# EAGLE schematic LoRa Node Schematic (EAGLE 8.6.0)
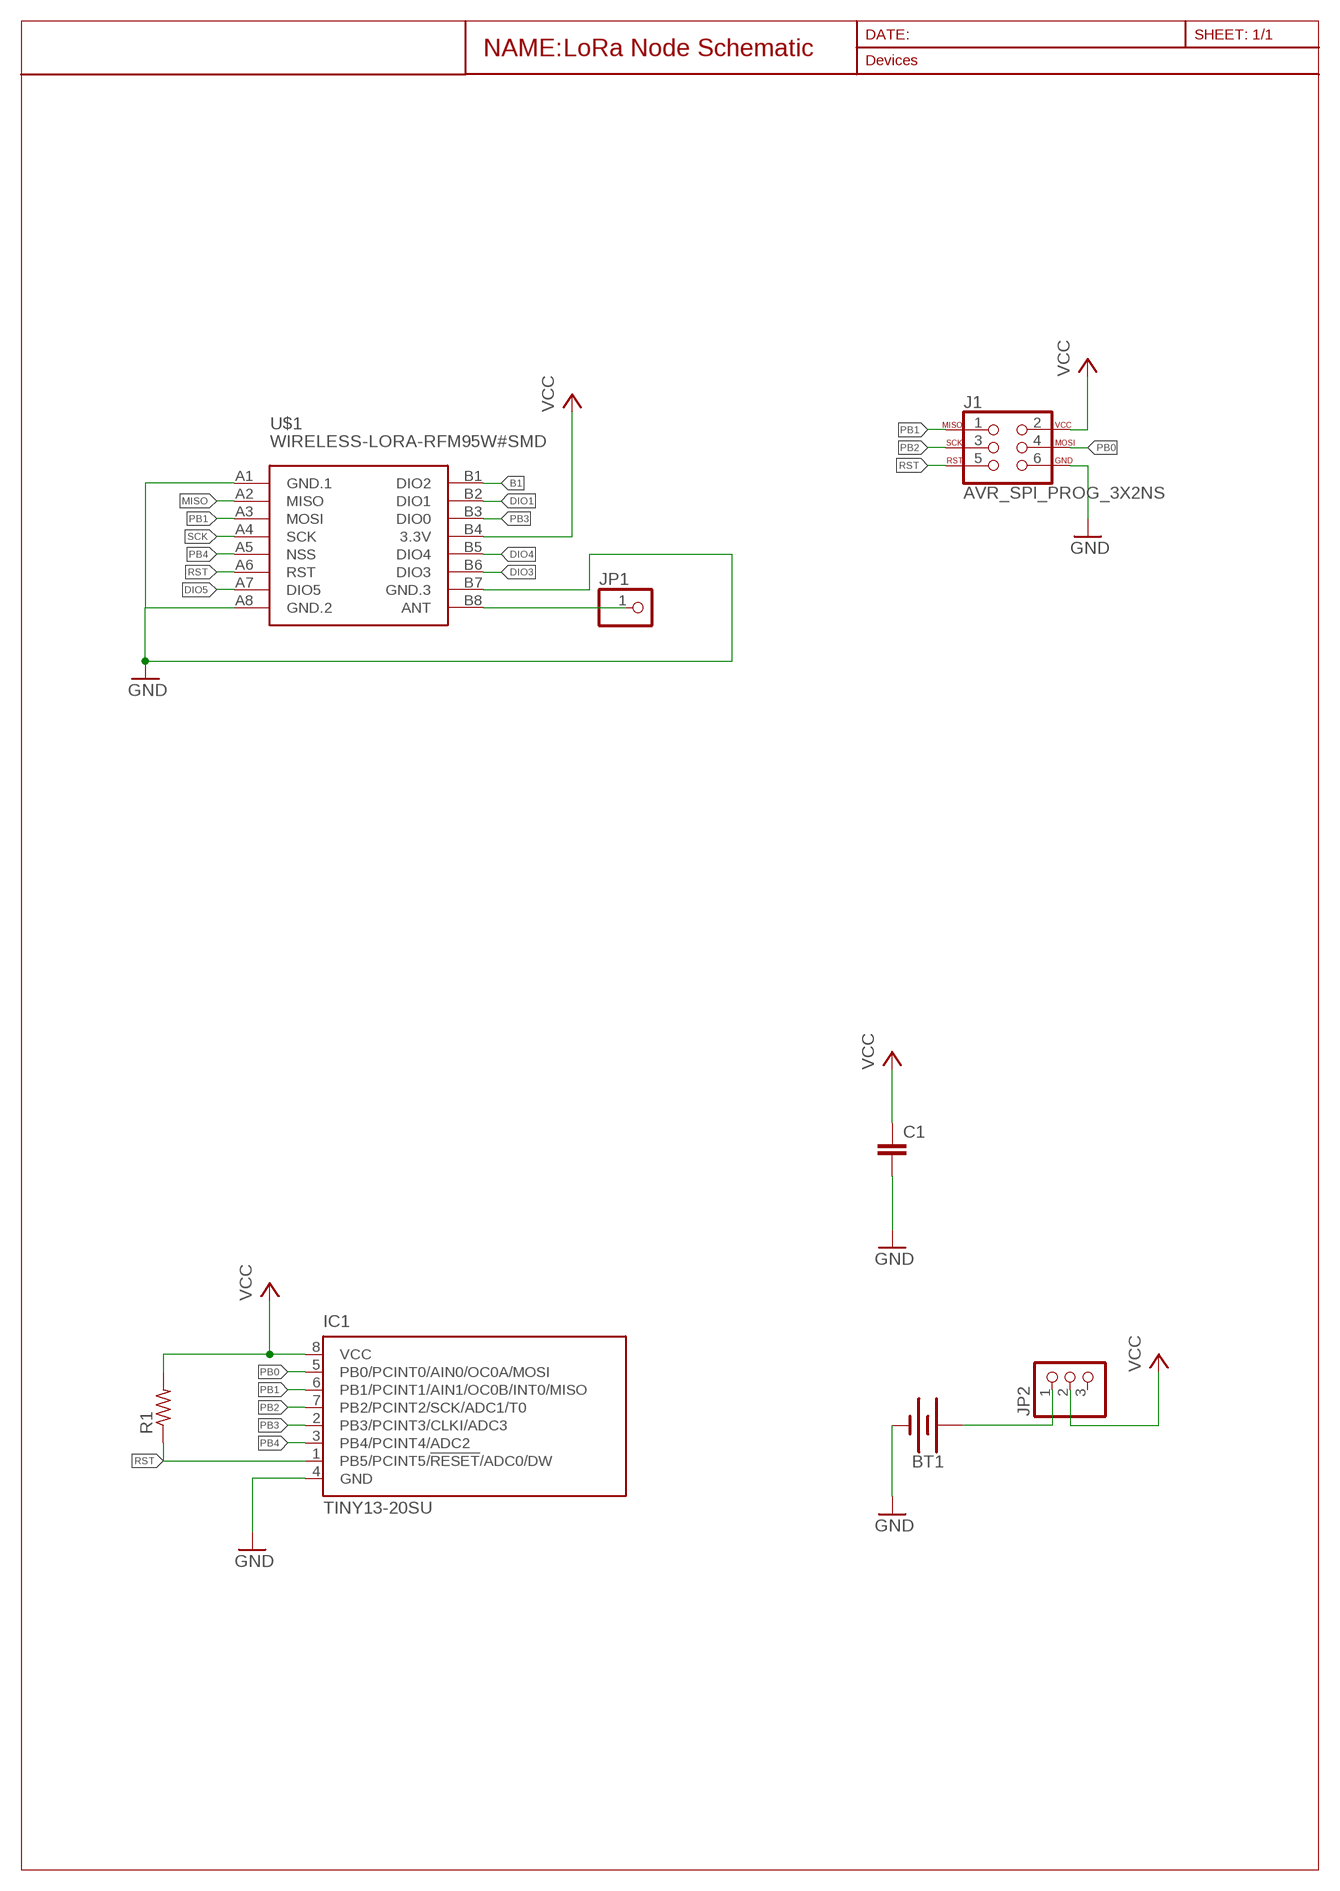
[diagram p0: schematic, sheet 1]
LORANODE (A4-35SC): NOME: LoRa Node

## Parts
BT1  BATTERY-20MM_PTH  [BATTCOM_20MM_PTH]
C1  C-EUC0603  [C0603]
IC1  TINY13-20SU  [8S2]
J1  AVR_SPI_PROG_3X2NS  [2X3-NS]
JP1  PINHD-1X1CB  [1X01-CLEANBIG]
JP2  PINHD-1X3  [1X03]
R1  R-US_R0603  [R0603]
U$1  WIRELESS-LORA-RFM95W#SMD  [WIRELESS-LORA-RFM95W#SMD]

## Nets
ANT: JP1.1 U$1.B8(ANT)
B1: U$1.B1(DIO2)
DIO1: U$1.B2(DIO1)
DIO3: U$1.B6(DIO3)
DIO4: U$1.B5(DIO4)
DIO5: U$1.A7(DIO5)
GND: BT1.2(-) C1.2 IC1.4(GND) J1.6 U$1.A1(GND.1) U$1.A8(GND.2) U$1.B7(GND.3)
MISO: U$1.A2(MISO)
N$20: BT1.1(+) JP2.1
PB0: IC1.5(PB0/PCINT0/AIN0/OC0A/MOSI) J1.4
PB1: IC1.6(PB1/PCINT1/AIN1/OC0B/INT0/MISO) J1.1 U$1.A3(MOSI)
PB2: IC1.7(PB2/PCINT2/SCK/ADC1/T0) J1.3
PB3: IC1.2(PB3/PCINT3/CLKI/ADC3) U$1.B3(DIO0)
PB4: IC1.3(PB4/PCINT4/ADC2) U$1.A5(NSS)
RST: IC1.1(PB5/PCINT5/!RESET!/ADC0/DW) J1.5 R1.1 U$1.A6(RST)
SCK: U$1.A4(SCK)
VCC: C1.1 IC1.8(VCC) J1.2 JP2.2 R1.2 U$1.B4(3.3V)
Unconnected: JP2.3

## Library data of the parts
BT1 = SparkFun-Batteries:BATTERY: Battery - Single Cell A variety of battery chemistries, sizes, and footprints. Device List: 20MM_PTH - Coin Cell Battery Holder - 20mm (PTH) <https://www.sparkfun.com/products/783> 6.8MM_PTH - Coin Cell Battery Holder - 6.8MM(SMD) <https://www.digikey.com/product-detail/en/seiko-instruments/MS621FE-FL11E/728-1057-ND/1889208?WT.srch=1&gclid=CNOQ5a6LzdQCFZS2wAodXCkE0g> 12MM_SMD - Coin Cell Battery Holder - 12mm (SMD) <https://www.sparkfun.com/products/10592> 12MM_PTH - Coin Cell Battery Holder - 12mm (PTH) <https://www.sparkfun.com/products/7948> 20MM_SMD - 20mm Coin Cell Battery Holder (SMD) (2 legs) Used on the Big Time Watch Kit <https://www.sparkfun.com/products/11734> 20MM_SMD_4LEGS - Coin Cell Battery Holder - 20mm (SMD) <https://www.sparkfun.com/products/11892> 20MM_SMD_4LEGS_OVERPASTE - Coin Cell Battery Holder - 20mm (SMD) <https://www.sparkfun.com/products/11892> (Over-paste on the legs) 24.5MM_PTH - Coin Cell Battery Holder - 24.5mm (PTH) <https://www.sparkfun.com/products/8863> 9V - 9V Battery Holder - PC Mount Used on the SparkFun SparkPunk Sound Kit <https://www.sparkfun.com/products/11177> and SparkFun SparkPunk Sequencer Kit <https://www.sparkfun.com/products/12707> 18650 - Battery Holder - 18650 (PTH) <https://www.sparkfun.com/products/13113> AA - Battery Holder - 1xAA (PTH) <https://www.sparkfun.com/products/7949> AAA - Battery Holder - 1xAAA (PTH) <https://www.sparkfun.com/products/12718> AA_KIT - Battery Holder - 1xAA (PTH) <https://www.sparkfun.com/products/7949> Special kit package - pads only have exposed copper on one side of the board. AAA_KIT - Battery Holder - 1xAAA (PTH) <https://www.sparkfun.com/products/12718> Special kit package - pads only have exposed copper on one side of the board.; PROD_ID: BATT-09031; SF_SKU: PRT-00783
C1 = rcl:C-EU: CAPACITOR, European symbol; SPICEPREFIX: C
IC1 = atmel:TINY13: 8-bit AVR Microcontroller with 1K Bytes In-System Programmable Flash Source: http://www.atmel.com/dyn/resources/prod_documents/2535S.pdf; MPN: ATTINY13-20SU; OC_FARNELL: 9171568; OC_NEWARK: 96K6522
J1 = SparkFun-Connectors:AVR_SPI_PROG_3X2: AVR ISP 6 Pin This is the reduced ISP connector for AVR programming. Common on Arduino. This footprint will take up less PCB space and can be used with a 10-pin to 6-pin adapter such as SKU: BOB-08508 **Special note about "TEST_POINT" package. The stop mask is on the top side, so if you want your programming test points to be on the bottom of your board, make sure to place this package on the bottom side of the board. This also ensure that the orientation to program from the bottom side will be correct. SparkFun Products: SparkFun ISP Pogo Adapter <https://www.sparkfun.com/products/11591> - NS Tiny AVR Programmer <https://www.sparkfun.com/products/11801> -PTH
JP1 = adafruit:PINHD-1X1: Pin header 1x1 for 0.1" spacing With round pins
JP2 = adafruit:PINHD-1X3: PIN HEADER
R1 = rcl:R-US_: RESISTOR, American symbol; SPICEPREFIX: R
U$1 = diy-modules:WIRELESS-LORA-RFM95W: 868/915 MHz LoRa Radio Transceiver Module based on SX1276 chip Click here to find device on ebay.com <http://www.ebay.com/sch/RFM95W+transceiver>